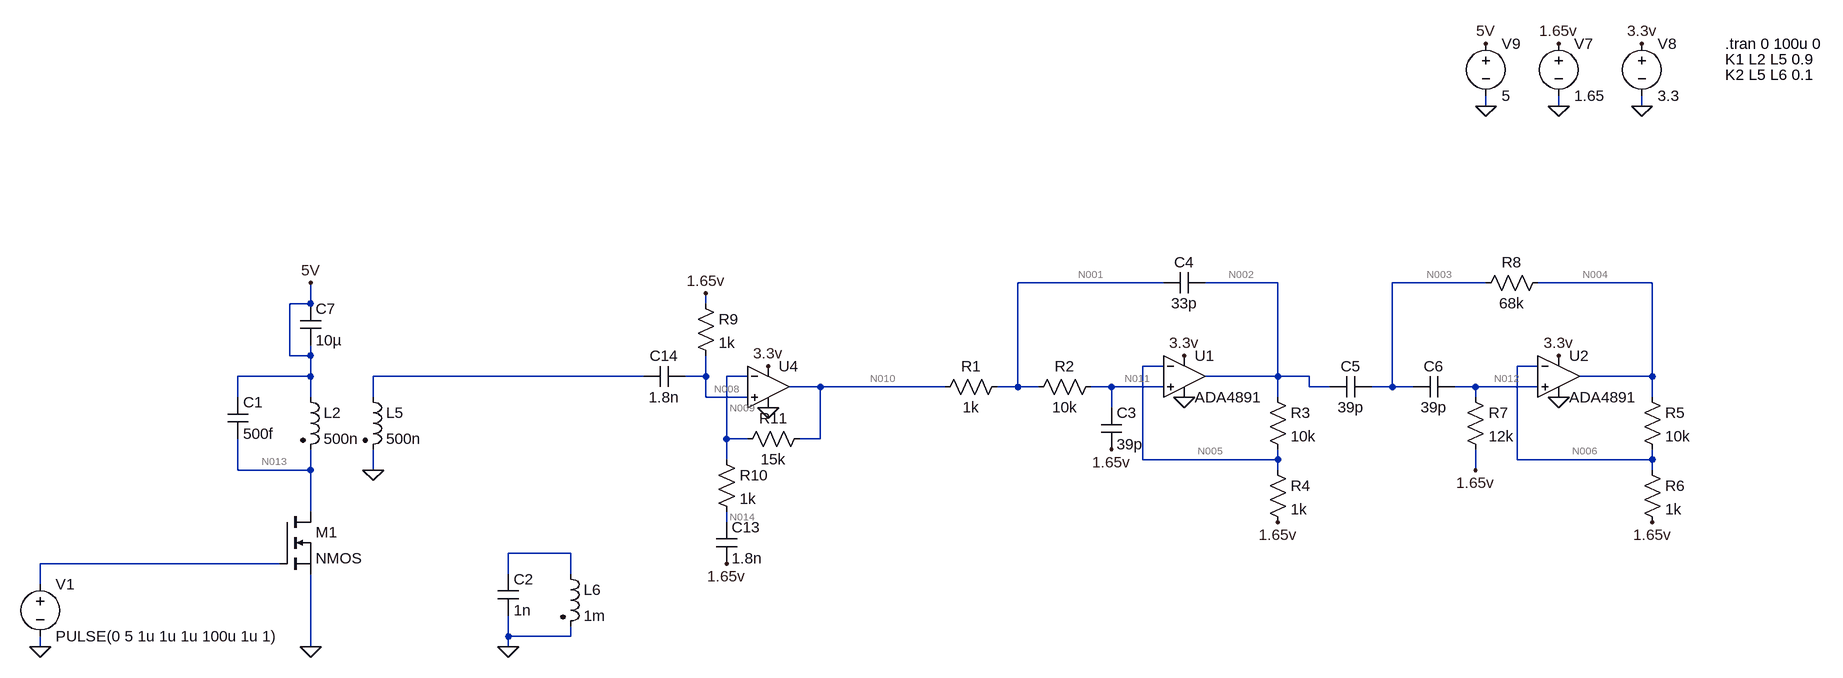
[diagram p0: schematic Draft2.asc]
Draft2.asc, the LTspice schematic file:
Version 4
SHEET 1 1140 732
WIRE -80 -272 -80 -288
WIRE 32 -272 32 -288
WIRE 160 -272 160 -288
WIRE -576 0 -800 0
WIRE -400 0 -512 0
WIRE -80 0 -224 0
WIRE 176 0 0 0
WIRE -1888 32 -1888 0
WIRE -1888 32 -1920 32
WIRE -1280 32 -1280 16
WIRE -1920 112 -1920 32
WIRE -1888 112 -1888 96
WIRE -1888 112 -1920 112
WIRE -576 128 -608 128
WIRE 0 128 -32 128
WIRE -1888 144 -1888 112
WIRE -1888 144 -2000 144
WIRE -1376 144 -1792 144
WIRE -1280 144 -1280 112
WIRE -1280 144 -1312 144
WIRE -1216 144 -1248 144
WIRE -400 144 -400 0
WIRE -400 144 -512 144
WIRE -352 144 -400 144
WIRE 176 144 176 0
WIRE 176 144 64 144
WIRE -1104 160 -1152 160
WIRE -912 160 -1104 160
WIRE -800 160 -800 0
WIRE -800 160 -832 160
WIRE -768 160 -800 160
WIRE -656 160 -688 160
WIRE -576 160 -656 160
WIRE -352 160 -352 144
WIRE -320 160 -352 160
WIRE -224 160 -224 0
WIRE -224 160 -256 160
WIRE -192 160 -224 160
WIRE -96 160 -128 160
WIRE 0 160 -96 160
WIRE -2000 176 -2000 144
WIRE -1888 176 -1888 144
WIRE -1792 176 -1792 144
WIRE -1280 176 -1280 144
WIRE -1216 176 -1280 176
WIRE -400 176 -400 144
WIRE -96 176 -96 160
WIRE 176 176 176 144
WIRE -656 192 -656 160
WIRE -1248 240 -1248 144
WIRE -1216 240 -1248 240
WIRE -1104 240 -1104 160
WIRE -1104 240 -1136 240
WIRE -1248 272 -1248 240
WIRE -608 272 -608 128
WIRE -400 272 -400 256
WIRE -400 272 -608 272
WIRE -32 272 -32 128
WIRE 176 272 176 256
WIRE 176 272 -32 272
WIRE -2000 288 -2000 240
WIRE -1888 288 -1888 256
WIRE -1888 288 -2000 288
WIRE -1792 288 -1792 256
WIRE -400 288 -400 272
WIRE -96 288 -96 256
WIRE 176 288 176 272
WIRE -1888 352 -1888 288
WIRE -1248 368 -1248 352
WIRE -1488 416 -1584 416
WIRE -1936 432 -2304 432
WIRE -1584 448 -1584 416
WIRE -1488 448 -1488 416
WIRE -2304 464 -2304 432
WIRE -1584 544 -1584 512
WIRE -1488 544 -1488 528
WIRE -1488 544 -1584 544
WIRE -2304 560 -2304 544
WIRE -1888 560 -1888 448
WIRE -1584 560 -1584 544
FLAG 32 -272 0
FLAG 160 -368 3.3v
FLAG 32 -368 1.65v
FLAG 160 -272 0
FLAG -80 -368 5V
FLAG -80 -272 0
FLAG -1888 560 0
FLAG -1888 0 5V
FLAG -2304 560 0
FLAG -1792 288 0
FLAG -1584 560 0
FLAG -1184 192 0
FLAG -1184 128 3.3v
FLAG -1280 16 1.65v
FLAG -1248 432 1.65v
FLAG -544 176 0
FLAG -544 112 3.3v
FLAG -656 256 1.65v
FLAG -400 368 1.65v
FLAG 32 176 0
FLAG 32 112 3.3v
FLAG -96 288 1.65v
FLAG 176 368 1.65v
SYMBOL voltage 32 -384 R0
WINDOW 123 0 0 Left 0
WINDOW 39 0 0 Left 0
SYMATTR InstName V7
SYMATTR Value 1.65
SYMBOL voltage 160 -384 R0
WINDOW 123 0 0 Left 0
WINDOW 39 0 0 Left 0
SYMATTR InstName V8
SYMATTR Value 3.3
SYMBOL voltage -80 -384 R0
WINDOW 123 0 0 Left 0
WINDOW 39 0 0 Left 0
SYMATTR InstName V9
SYMATTR Value 5
SYMBOL nmos -1936 352 R0
SYMATTR InstName M1
SYMBOL ind2 -1904 160 R0
SYMATTR InstName L2
SYMATTR Value 500n
SYMATTR Type ind
SYMBOL voltage -2304 448 R0
WINDOW 123 0 0 Left 0
WINDOW 39 0 0 Left 0
SYMATTR InstName V1
SYMATTR Value PULSE(0 5 1u 1u 1u 100u 1u 1)
SYMBOL cap -2016 176 R0
SYMATTR InstName C1
SYMATTR Value 500f
SYMBOL ind2 -1808 160 R0
SYMATTR InstName L5
SYMATTR Value 500n
SYMATTR Type ind
SYMBOL ind2 -1504 432 R0
SYMATTR InstName L6
SYMATTR Value 1m
SYMATTR Type ind
SYMBOL cap -1600 448 R0
SYMATTR InstName C2
SYMATTR Value 1n
SYMBOL OpAmps\\ADA4891 -544 80 R0
SYMATTR InstName U1
SYMBOL res -816 144 R90
WINDOW 0 0 56 VBottom 2
WINDOW 3 32 56 VTop 2
SYMATTR InstName R1
SYMATTR Value 1k
SYMBOL res -672 144 R90
WINDOW 0 0 56 VBottom 2
WINDOW 3 32 56 VTop 2
SYMATTR InstName R2
SYMATTR Value 10k
SYMBOL cap -672 192 R0
SYMATTR InstName C3
SYMATTR Value 39p
SYMBOL cap -512 -16 R90
WINDOW 0 0 32 VBottom 2
WINDOW 3 32 32 VTop 2
SYMATTR InstName C4
SYMATTR Value 33p
SYMBOL res -416 160 R0
SYMATTR InstName R3
SYMATTR Value 10k
SYMBOL res -416 272 R0
SYMATTR InstName R4
SYMATTR Value 1k
SYMBOL OpAmps\\ADA4891 32 80 R0
SYMATTR InstName U2
SYMBOL res 160 160 R0
SYMATTR InstName R5
SYMATTR Value 10k
SYMBOL res 160 272 R0
SYMATTR InstName R6
SYMATTR Value 1k
SYMBOL cap -256 144 R90
WINDOW 0 0 32 VBottom 2
WINDOW 3 32 32 VTop 2
SYMATTR InstName C5
SYMATTR Value 39p
SYMBOL cap -128 144 R90
WINDOW 0 0 32 VBottom 2
WINDOW 3 32 32 VTop 2
SYMATTR InstName C6
SYMATTR Value 39p
SYMBOL res -112 160 R0
SYMATTR InstName R7
SYMATTR Value 12k
SYMBOL res 16 -16 R90
WINDOW 0 0 56 VBottom 2
WINDOW 3 32 56 VTop 2
SYMATTR InstName R8
SYMATTR Value 68k
SYMBOL res -1296 16 R0
SYMATTR InstName R9
SYMATTR Value 1k
SYMBOL res -1264 256 R0
SYMATTR InstName R10
SYMATTR Value 1k
SYMBOL res -1120 224 R90
WINDOW 0 0 56 VBottom 2
WINDOW 3 32 56 VTop 2
SYMATTR InstName R11
SYMATTR Value 15k
SYMBOL cap -1264 368 R0
SYMATTR InstName C13
SYMATTR Value 1.8n
SYMBOL cap -1312 128 R90
WINDOW 0 0 32 VBottom 2
WINDOW 3 32 32 VTop 2
SYMATTR InstName C14
SYMATTR Value 1.8n
SYMBOL OpAmps\\UniversalOpAmp2 -1184 160 R0
SYMATTR InstName U4
SYMATTR Value2 Avol=1Meg GBW=20Meg Slew=10Meg
SYMBOL cap -1904 32 R0
SYMATTR InstName C7
SYMATTR Value 10µ
TEXT 288 -344 Left 2 !K1 L2 L5 0.9
TEXT 288 -368 Left 2 !.tran 0 100u 0
TEXT 288 -320 Left 2 !K2 L5 L6 0.1

The netlist it stands for:
* Draft2.asc
V7 1.65v 0 1.65
V8 3.3v 0 3.3
V9 5V 0 5
M1 N013 N016 0 0 NMOS
L2 5V N013 500n
V1 N016 0 PULSE(0 5 1u 1u 1u 100u 1u 1)
C1 5V N013 500f
L5 N007 0 500n
L6 N015 0 1m
C2 N015 0 1n
XU1 N011 N005 3.3v 0 N002 ADA4891-1  ; pins In+ In- V+ V- OUT
R1 N001 N010 1k
R2 N011 N001 10k
C3 N011 1.65v 39p
C4 N002 N001 33p
R3 N002 N005 10k
R4 N005 1.65v 1k
XU2 N012 N006 3.3v 0 N004 ADA4891-1  ; pins In+ In- V+ V- OUT
R5 N004 N006 10k
R6 N006 1.65v 1k
C5 N003 N002 39p
C6 N012 N003 39p
R7 N012 1.65v 12k
R8 N004 N003 68k
R9 1.65v N008 1k
R10 N009 N014 1k
R11 N010 N009 15k
C13 N014 1.65v 1.8n
C14 N008 N007 1.8n
XU4 N008 N009 3.3v 0 N010 level2 Avol=1Meg GBW=20Meg Slew=10Meg Ilimit=25m Rail=0 Vos=0 En=0 Enk=0 In=0 Ink=0 Rin=500Meg  ; pins In+ In- V+ V- OUT
C7 5V 5V 10µ
.model NMOS NMOS
.model PMOS PMOS
.lib standard.mos
K1 L2 L5 0.9
.tran 0 100u 0
K2 L5 L6 0.1
.lib ADA4891-1.lib
.lib UniversalOpAmp2.lib
.backanno
.end

* Results of the author's LTspice run, read from the files saved beside the schematic
* Operating Point, zero values left out:
*   V(1.65v) = 1.65 V
*   V(3.3v) = 3.3 V
*   V(5v) = 5 V
*   V(n013) = 5 V
*   V(n011) = 1.65 V
*   V(n002) = 1.666 V
*   V(n005) = 1.651 V
*   V(n001) = 1.65 V
*   V(n010) = 1.65 V
*   V(n012) = 1.65 V
*   V(n004) = 1.666 V
*   V(n006) = 1.651 V
*   V(n003) = 1.666 V
*   V(n008) = 1.65 V
*   V(n009) = 1.65 V
*   V(n014) = 1.65 V
*   Id(M1) = 10.01 pA
*   Ib(M1) = -5.01 pA
*   Is(M1) = -5 pA
*   I(L2) = 10.01 pA
*   I(R7) = -110 pA
*   I(R6) = 1.419 µA
*   I(R5) = 1.419 µA
*   I(R4) = 1.419 µA
*   I(R3) = 1.419 µA
*   I(R2) = -110.3 pA
*   I(R1) = -110.3 pA
*   I(V9) = -10.01 pA
*   I(V8) = -8.968 mA
*   I(V7) = 2.837 µA
*   Ix(u1:1) = 110.1 pA
*   Ix(u1:2) = -104.1 pA
*   Ix(u1:3) = 4.401 mA
*   Ix(u1:4) = -4.401 mA
*   Ix(u1:5) = -1.419 µA
*   Ix(u2:1) = 110.1 pA
*   Ix(u2:2) = -104.1 pA
*   Ix(u2:3) = 4.401 mA
*   Ix(u2:4) = -4.401 mA
*   Ix(u2:5) = -1.419 µA
*   Ix(u4:3) = 165 µA
*   Ix(u4:4) = -165 µA
*   Ix(u4:5) = -110.3 pA
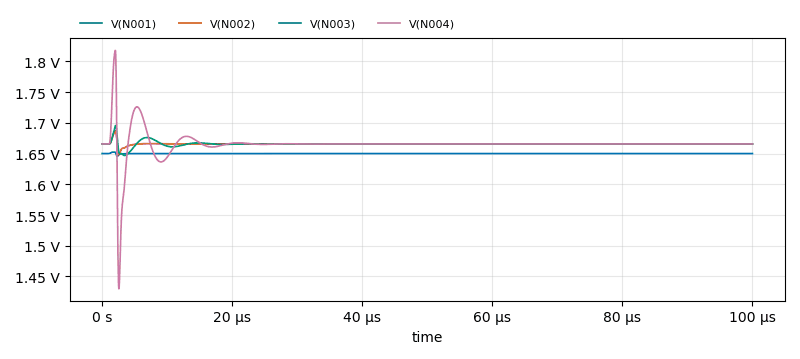
[diagram p1: Transient Analysis of Draft2.asc, plotted from the saved traces]
* Transient Analysis, 1 run:
*   V(N001): min 1.645 V, max 1.652 V, average 1.65 V, rms 1.65 V, last 1.65 V
*   V(N002): min 1.648 V, max 1.687 V, average 1.666 V, rms 1.666 V, last 1.666 V
*   V(N003): min 1.647 V, max 1.696 V, average 1.666 V, rms 1.666 V, last 1.666 V
*   V(N004): min 1.43 V, max 1.818 V, average 1.666 V, rms 1.666 V, last 1.666 V